# Altium schematic sheet Sheet1.SchDoc: -
size A4; Author: -; CompanyName: IOElectro; DrawnBy: Esmaeill M; Engineer: -; Organization: IOElectro; Address1: Bushehr,Iran; Address2: www.ioelectro.ir; Revision: -; SheetNumber: 1; SheetTotal: 1; ProjectNumber: -; Note: -
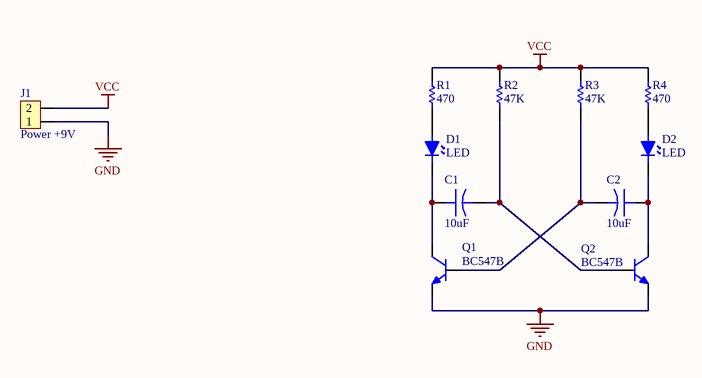
[diagram p0: Sheet1.SchDoc]

## Parts
C1  10uF  [C-EL_5x11x2mm]
C2  10uF  [C-EL_5x11x2mm]
D1  LED  [LED-3MM]
D2  LED  [LED-3MM]
J1  Power +9V  [PH-1X2-N3D]
Q1  BC547B  [TO-92]
Q2  BC547B  [TO-92]
R1  470  [R-1/4W-DIP]
R2  47K  [R-1/4W-DIP]
R3  47K  [R-1/4W-DIP]
R4  470  [R-1/4W-DIP]

## Nets
GND: J1.1 Q1.3(E) Q2.3(E)
VCC: J1.2 R1.2 R2.2 R3.2 R4.2
NetC1_A: C1.A D1.K Q1.1(C)
NetC1_K: C1.K Q2.2(B) R2.1
NetC2_A: C2.A D2.K Q2.1(C)
NetC2_K: C2.K Q1.2(B) R3.1
NetD1_A: D1.A R1.1
NetD2_A: D2.A R4.1

## Notes on the sheet
- Title
- Size:
- Date:
- A4
- Project Number:
- Time:
- Revision:
- Sheet
- of
- Drawn By:
- IOElectro
- File:
- Note:

## Library data of the parts
C1 C2 = CAP-EL: CAPACITOR ELECTROLYTIC
J1 = PH-1X2: PIN HEADER 1x2 2.56mm
Q1 Q2 = BC547B: NPN TRANSISTOR 1.5A 40V SOT-23 R; Manufacturer: ON Semiconductor / Fairchild; Collector Emitter Voltage (VCEO): 45V; Max Power Dissipation: 500mW; Max Collector Current: 100mA; Collector Base Voltage (VCBO): 50V; Emitter Base Voltage (VEBO): 6V; Element Configuration: Single; Number of Elements: 1; hFE Min: 200; Frequency: 300MHz; Gain Bandwidth Product: 100MHz; Collector Emitter Saturation Voltage: 300mV; Supplier 1: Digi-Key; Manufacturer Part Number: BC547B; RoHS: Yes; Category: BJTs; Stock 1: 3549; Pricing 1: 1=0/50000, 10=0/36900, 25=0/32280, 100=0/20890, 500=0/13832, 1000=0/10605, 2500=0/09222, 5000=0/08300 (USD); Mount: Through Hole; Case/Package: TO-92; Number of Pins: 3; Weight: 0.007055oz; Contact Plating: Copper,Tin,Silver; Min Operating Temperature: -65°C; Max Operating Temperature: 150°C; Packaging: Bulk; Polarity: NPN; Power Dissipation: 500mW; Package Quantity: 2000; Voltage Rating (DC): 45V; Current Rating: 100mA; Collector Emitter Breakdown Voltage: 45V; Transition Frequency: 300MHz; Max Frequency: 300MHz; Max Breakdown Voltage: 45V; Voltage: 40V; Length: 4.58mm; Width: 3.86mm; Height: 4.58mm; Radiation Hardening: No; Lead Free: Lead Free; REACH SVHC: No SVHC; ComponentLink1URL: https://datasheet.ciiva.com/17011/bc547-17011404.pdf?src-supplier=Future+Electronics; ComponentLink1Description: https://datasheet.ciiva.com/17011/bc547-17011404.pdf?src-supplier=Future+Electronics; ComponentLink2URL: https://datasheet.ciiva.com/985/bc546-547-548rev5-985523.pdf?src-supplier=Digi-Key; ComponentLink2Description: https://datasheet.ciiva.com/985/bc546-547-548rev5-985523.pdf?src-supplier=Digi-Key; ComponentLink3URL: https://datasheet.ciiva.com/972/bc546-972262.pdf?src-supplier=Digi-Key; ComponentLink3Description: https://datasheet.ciiva.com/972/bc546-972262.pdf?src-supplier=Digi-Key; ComponentLink4URL: https://datasheet.ciiva.com/1195/1868820-1195464.pdf?src-supplier=Element14; ComponentLink4Description: https://datasheet.ciiva.com/1195/1868820-1195464.pdf?src-supplier=Element14; ComponentLink5URL: https://datasheet.ciiva.com/25996/bc550-25996616.pdf?src-supplier=Avnet+Europe; ComponentLink5Description: https://datasheet.ciiva.com/25996/bc550-25996616.pdf?src-supplier=Avnet+Europe; ComponentLink6URL: https://datasheet.ciiva.com/11197/bc550-11197769.pdf?src-supplier=Avnet; ComponentLink6Description: https://datasheet.ciiva.com/11197/bc550-11197769.pdf?src-supplier=Avnet; ComponentLink7URL: https://datasheet.ciiva.com/16472/bc550-16472201.pdf?src-supplier=Avnet+Asia; ComponentLink7Description: https://datasheet.ciiva.com/16472/bc550-16472201.pdf?src-supplier=Avnet+Asia; Supplier Part Number 1: BC547BFS-ND; Supplier 2: Digi-Key; Stock 2: 349867; Pricing 2: 1=0.24000, 10=0.20000, 100=0.10620, 500=0.06986, 1000=0.04751 (USD); ComponentLink8URL: http://www.comchiptech.com/admin/files/product/SS8050-G RevA181526.pdf?src-supplier=Digi-Key; ComponentLink8Description: http://www.comchiptech.com/admin/files/product/SS8050-G RevA181526.pdf?src-supplier=Digi-Key; ComponentLink9URL: http://www.comchiptech.com/cms/UserFiles/SS8050-G%20RevA181526.pdf?src-supplier=Digi-Key; ComponentLink9Description: http://www.comchiptech.com/cms/UserFiles/SS8050-G%20RevA181526.pdf?src-supplier=Digi-Key; Supplier Part Number 2: 641-1790-1-ND
R1-R4 = RES